# EAGLE design OPT_4ch (EAGLE 7.5.0)
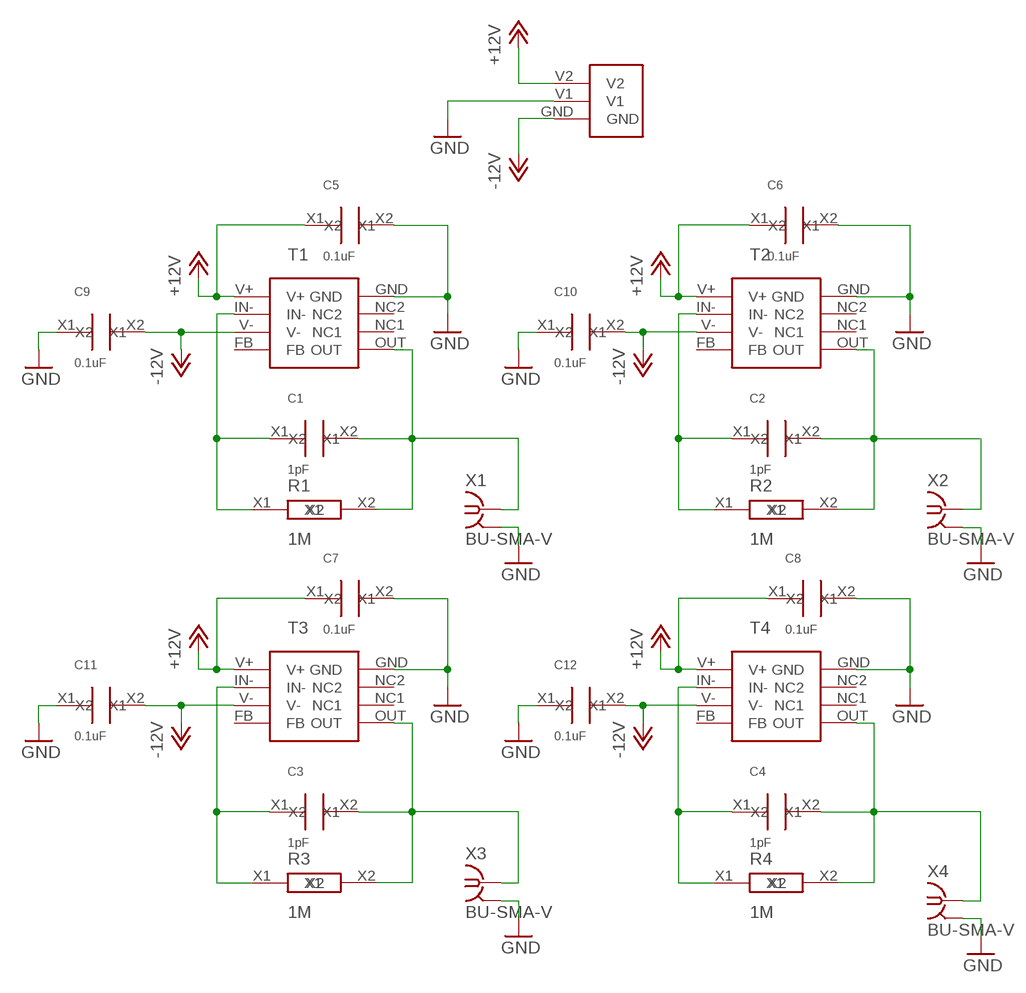
[diagram p0: schematic, sheet 1]

## Parts
C1  1pF  C_SMD_2.1X1.25  [SMD_2.1X1.25]
C2  1pF  C_SMD_2.1X1.25  [SMD_2.1X1.25]
C3  1pF  C_SMD_2.1X1.25  [SMD_2.1X1.25]
C4  1pF  C_SMD_2.1X1.25  [SMD_2.1X1.25]
C5  0.1uF  C_SMD_2.1X1.25  [SMD_2.1X1.25]
C6  0.1uF  C_SMD_2.1X1.25  [SMD_2.1X1.25]
C7  0.1uF  C_SMD_2.1X1.25  [SMD_2.1X1.25]
C8  0.1uF  C_SMD_2.1X1.25  [SMD_2.1X1.25]
C9  0.1uF  C_SMD_2.1X1.25  [SMD_2.1X1.25]
C10  0.1uF  C_SMD_2.1X1.25  [SMD_2.1X1.25]
C11  0.1uF  C_SMD_2.1X1.25  [SMD_2.1X1.25]
C12  0.1uF  C_SMD_2.1X1.25  [SMD_2.1X1.25]
R1  1M  R_SMD_2.1X1.25  [SMD_2.1X1.25]
R2  1M  R_SMD_2.1X1.25  [SMD_2.1X1.25]
R3  1M  R_SMD_2.1X1.25  [SMD_2.1X1.25]
R4  1M  R_SMD_2.1X1.25  [SMD_2.1X1.25]
T1  OPT101  [OPT101]
T2  OPT101  [OPT101]
T3  OPT101  [OPT101]
T4  OPT101  [OPT101]
U$1  BAT3_PLUG  [BAT3_PLUG]
X1  BU-SMA-V  [BU-SMA-V]
X2  BU-SMA-V  [BU-SMA-V]
X3  BU-SMA-V  [BU-SMA-V]
X4  BU-SMA-V  [BU-SMA-V]

## Nets
+12V: C5.X1 C6.X1 C7.X1 C8.X1 T1.V+ T2.V+ T3.V+ T4.V+ U$1.V2
-12V: C9.X2 C10.X2 C11.X2 C12.X2 T1.V- T2.V- T3.V- T4.V- U$1.GND
GND: C5.X2 C6.X2 C7.X2 C8.X2 C9.X1 C10.X1 C11.X1 C12.X1 T1.GND T2.GND T3.GND T4.GND U$1.V1 X1.2 X1.3 X1.4 X1.5 X2.2 X2.3 X2.4 X2.5 X3.2 X3.3 X3.4 X3.5 X4.2 X4.3 X4.4 X4.5
N$1: C1.X1 R1.X1 T1.IN-
N$2: C1.X2 R1.X2 T1.OUT X1.1
N$3: C3.X1 R3.X1 T3.IN-
N$4: C3.X2 R3.X2 T3.OUT X3.1
N$5: C2.X1 R2.X1 T2.IN-
N$6: C2.X2 R2.X2 T2.OUT X2.1
N$7: C4.X2 R4.X2 T4.OUT X4.1
N$8: C4.X1 R4.X1 T4.IN-
Unconnected: T1.FB T1.NC1 T1.NC2 T2.FB T2.NC1 T2.NC2 T3.FB T3.NC1 T3.NC2 T4.FB T4.NC1 T4.NC2

## Library data of the parts
C1-C12 = MyPowerComponents:C_SMD_2.1X1.25
R1-R4 = MyPowerComponents:R_SMD_2.1X1.25
T1-T4 = My_OPT:OPT101
U$1 = MyDuino:BAT3_PLUG
X1-X4 = con-coax:BU-SMA-V: FEMALE SMA CONNECTOR Radiall distributor RS 112-3794; OC_FARNELL: unknown; OC_NEWARK: unknown

## Board
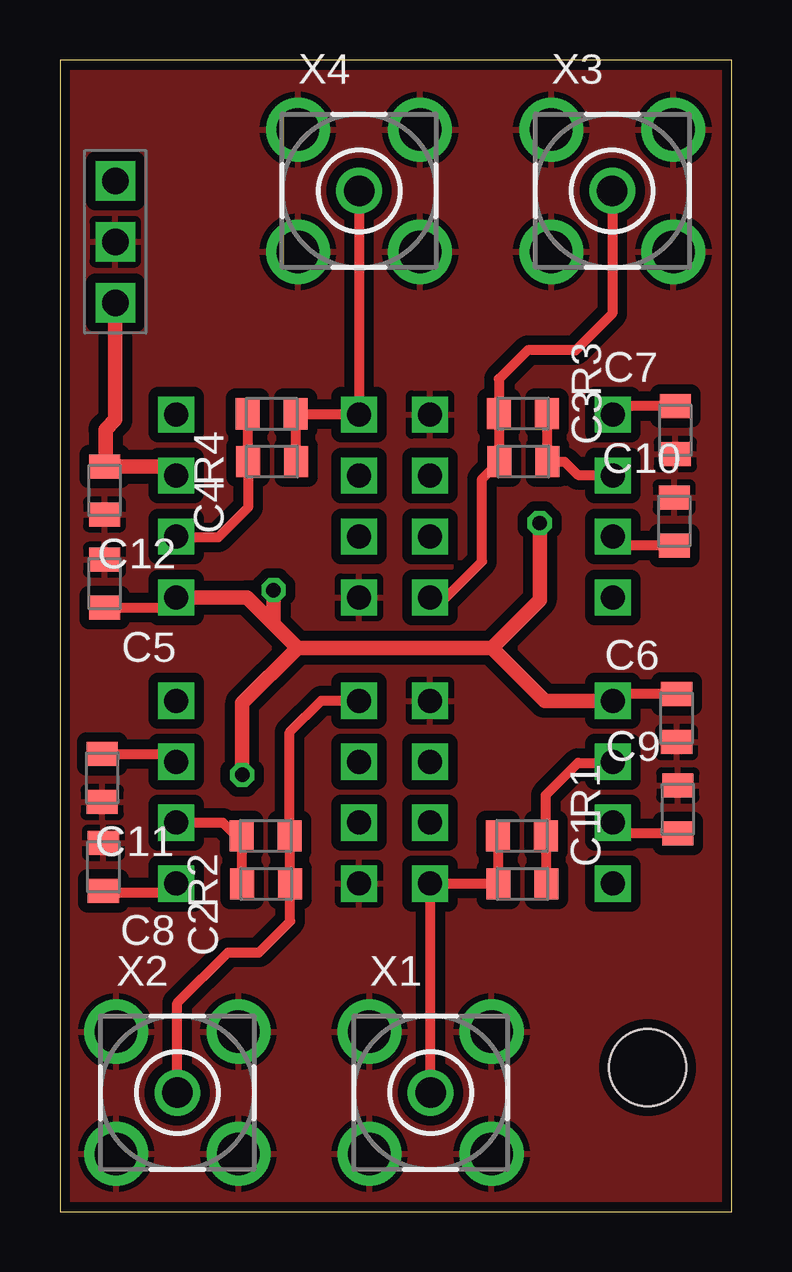
[diagram p1: board, top side]
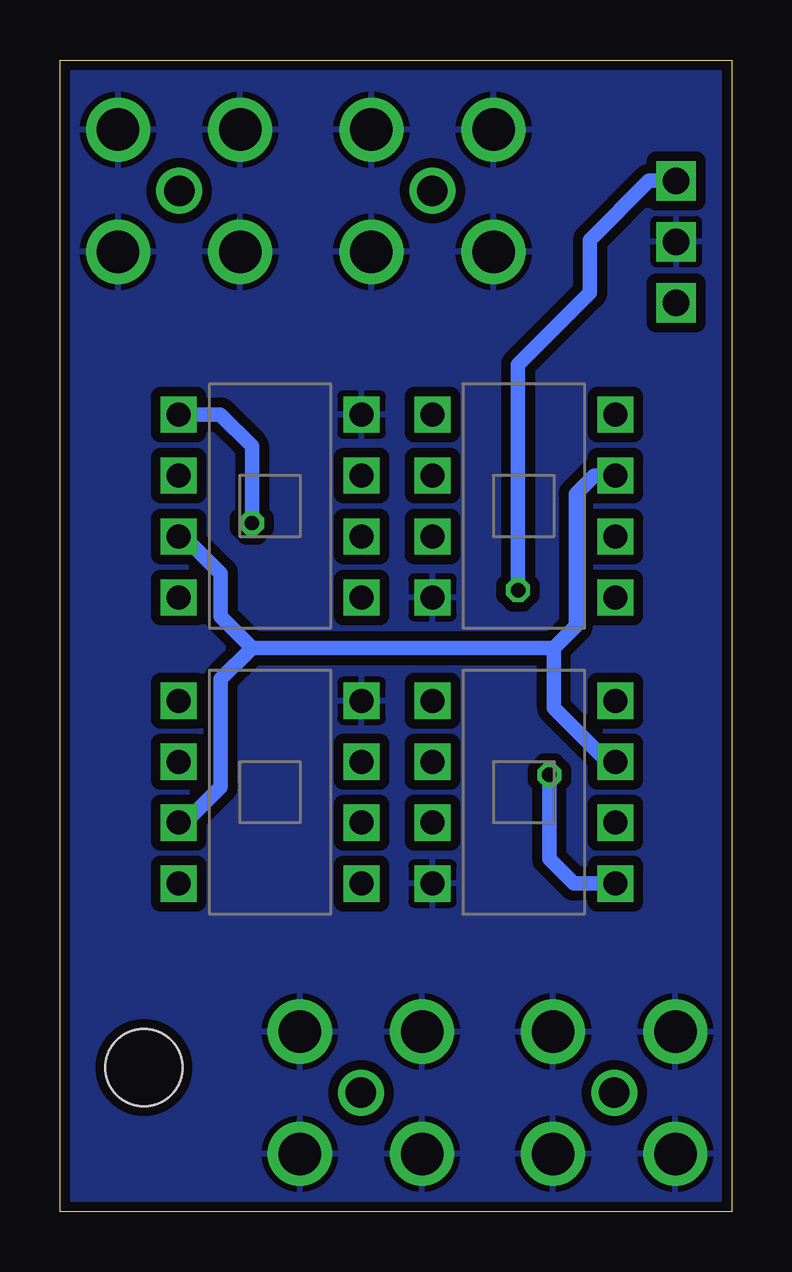
[diagram p2: board, bottom side, seen from below]

Size 28 x 48 mm. Coordinates in mm from the lower left corner, seen from the top.
Outline: 0,0 28,0 28,48 0,48 0,0
Copper layers (1*16): Top 0.035mm / dielectric 1.5mm / Bottom 0.035mm
Design rules "default *": minimum track width 10mil, minimum drill 24mil, track to track 8mil, track to pad 8mil, pad to pad 8mil, via to via 8mil, smd to smd 8mil, copper to edge 10mil, drill to drill 8mil, minimum pad ring 10mil, minimum via ring 8mil, stop-mask expansion 4mil, vias tented up to drill 0mil, thermal gap 10mil
Holes 3.2 mm at 24.5,6

### Footprints (pad centres in the part's own frame; a part is rotated, then mirrored left to right if it is on the bottom)
SMD_2.1X1.25 = smd 1.3 x 1: X1 0,1; X2 0,-1
OPT101 = drill 1 square: FB -3.81,-3.81; GND 3.81,3.81; IN- -3.81,1.27; NC1 3.81,-1.27; NC2 3.81,1.27; OUT 3.81,-3.81; V+ -3.81,3.81; V- -3.81,-1.27
BAT3_PLUG = drill 1.1 square: GND 0,-2.54; V1 0,0; V2 0,2.54
BU-SMA-V = drill 1.27: 1 0,0 | drill 1.778: 2 -2.55,2.55; 3 2.55,2.55; 4 2.55,-2.55; 5 -2.55,-2.55

### Placement (x,y rotation side)
C1  19.28,13.66 270 top
C2  8.6,13.66 90 top
C3  19.32,31.26 270 top
C4  8.84,31.26 90 top
C5  1.86,26.17 180 top
C6  25.71,20.57 0 top
C7  25.66,32.57 0 top
C8  1.81,14.37 180 top
C9  25.76,16.77 0 top
C10  25.61,28.77 0 top
C11  1.76,18.07 180 top
C12  1.86,30.06 180 top
R1  19.26,15.66 270 top
R2  8.58,15.66 90 top
R3  19.3,33.26 270 top
R4  8.83,33.25 90 top
T1  19.24,17.48 0 bottom
T2  8.66,17.48 180 bottom
T3  19.24,29.41 0 bottom
T4  8.66,29.41 180 bottom
U$1  2.31,40.42 0 top
X1  15.45,4.95 0 top
X2  4.89,4.95 0 top
X3  23.03,42.55 0 top
X4  12.47,42.55 0 top

### Tracks (layer width: path | path; a pad name or v marks a point on that pad's centre or on a via)
+12V  (via drill 0.6)
  Top 0.406: C7.X1 23.4,33.57 T3.V+ | C6.X1 23.33,21.57 T1.V+ | C8.X1 2.23,13.37 2.3,13.3 4.48,13.3 T2.V+ | C5.X1 4.42,25.17 T4.V+
  Top 0.61: T1.V+ 20.21,21.29 18,23.5 | 18,23.5 9.9,23.5 | v8.9,25.9 8.9,24.5 | 8.9,24.5 9.9,23.5 | T4.V+ 7.8,25.6 8.9,24.5 | v7.6,18.2 7.6,21.2 9.9,23.5 | v20,28.7 20,25.5 18,23.5
  Bottom 0.61: U$1.V2 3.44,42.96 5.9,40.5 5.9,38.3 8.9,35.3 v8.9,25.9 | T2.V+ 6.57,13.67 7.6,14.7 v7.6,18.2 | T3.V+ 21.32,33.22 20,31.9 v20,28.7
-12V
  Top 0.406: C10.X2 23.42,27.77 T3.V- | C9.X2 23.49,15.77 T1.V- | C11.X2 4.53,19.07 T2.V-
  Top 0.61: U$1.GND 2.31,33.01 1.9,32.6 1.9,31.1 C12.X2 4.47,31.06 T4.V-
  Bottom 0.61: T1.V- 22.79,16.21 21.3,17.7 21.3,22.2 20,23.5 | 20,23.5 7.4,23.5 | T4.V- 5.72,30.68 6.5,29.9 6.5,24.4 7.4,23.5 | T2.V- 5.15,18.75 7.4,21 7.4,23.5 | 20,23.5 21.3,24.8 21.3,26.6 22.84,28.14 T3.V-
GND
  pour Bottom (isolate 0.406): 0,0 28,0 28,48 0,48
  pour Top (isolate 0.406): 0,0 28,0 28,48 0,48
N$1
  Top 0.406: C1.X1 20.28,15.64 R1.X1 20.26,17.36 21.6,18.7 23,18.7 T1.IN-
N$2
  Top 0.406: R1.X2 18.28,15.64 C1.X2 T1.OUT 15.45,13.65 X1.1
N$3
  Top 0.406: R3.X1 20.3,31.28 C3.X1 21.04,31.26 21.6,30.7 23.03,30.7 T3.IN-
N$4
  Top 0.406: X3.1 23.03,37.43 21.5,35.9 19.5,35.9 18.3,34.7 R3.X2 18.3,31.28 C3.X2 17.6,30.54 17.6,27.1 16.1,25.6 T3.OUT
N$5
  Top 0.406: C2.X1 7.6,15.64 R2.X1 7.34,15.66 6.8,16.2 T2.IN-
N$6
  Top 0.406: T2.OUT 10.9,21.3 9.58,19.98 R2.X2 9.58,13.68 C2.X2 9.6,12.1 8.3,10.8 7,10.8 4.89,8.69 X2.1
N$7
  Top 0.406: C4.X2 R4.X2 12.44,33.25 T4.OUT X4.1
N$8
  Top 0.406: R4.X1 C4.X1 7.84,29.34 6.6,28.1 4.89,28.1 T4.IN-
N$9
  Top 0.61: 2.1,31 2.3,31